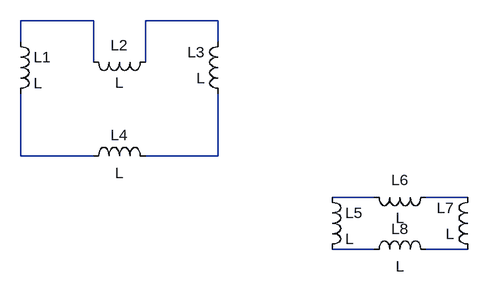
[diagram p0: schematic inductors.asc]
inductors.asc, the LTspice schematic file:
Version 4
SHEET 1 880 680
WIRE 192 64 80 64
WIRE 384 64 272 64
WIRE 80 96 80 64
WIRE 384 96 384 64
WIRE 192 128 192 64
WIRE 272 128 272 64
WIRE 80 272 80 176
WIRE 192 272 80 272
WIRE 384 272 384 176
WIRE 384 272 272 272
WIRE 624 336 560 336
WIRE 768 336 704 336
WIRE 624 416 560 416
WIRE 768 416 704 416
SYMBOL ind 64 80 R0
SYMATTR InstName L1
SYMBOL ind 288 112 R90
WINDOW 0 5 56 VBottom 2
WINDOW 3 32 56 VTop 2
SYMATTR InstName L2
SYMBOL ind 400 192 R180
WINDOW 0 36 80 Left 2
WINDOW 3 36 40 Left 2
SYMATTR InstName L3
SYMBOL ind 176 288 R270
WINDOW 0 32 56 VTop 2
WINDOW 3 5 56 VBottom 2
SYMATTR InstName L4
SYMBOL ind 544 320 R0
SYMATTR InstName L5
SYMBOL ind 720 320 R90
WINDOW 0 5 56 VBottom 2
WINDOW 3 32 56 VTop 2
SYMATTR InstName L6
SYMBOL ind 784 432 R180
WINDOW 0 36 80 Left 2
WINDOW 3 36 40 Left 2
SYMATTR InstName L7
SYMBOL ind 608 432 R270
WINDOW 0 32 56 VTop 2
WINDOW 3 5 56 VBottom 2
SYMATTR InstName L8

The netlist it stands for:
* inductors.asc
L1 N001 N003 L
L2 N002 N001 L
L3 N004 N002 L
L4 N003 N004 L
L5 N005 N007 L
L6 N006 N005 L
L7 N008 N006 L
L8 N007 N008 L
.backanno
.end